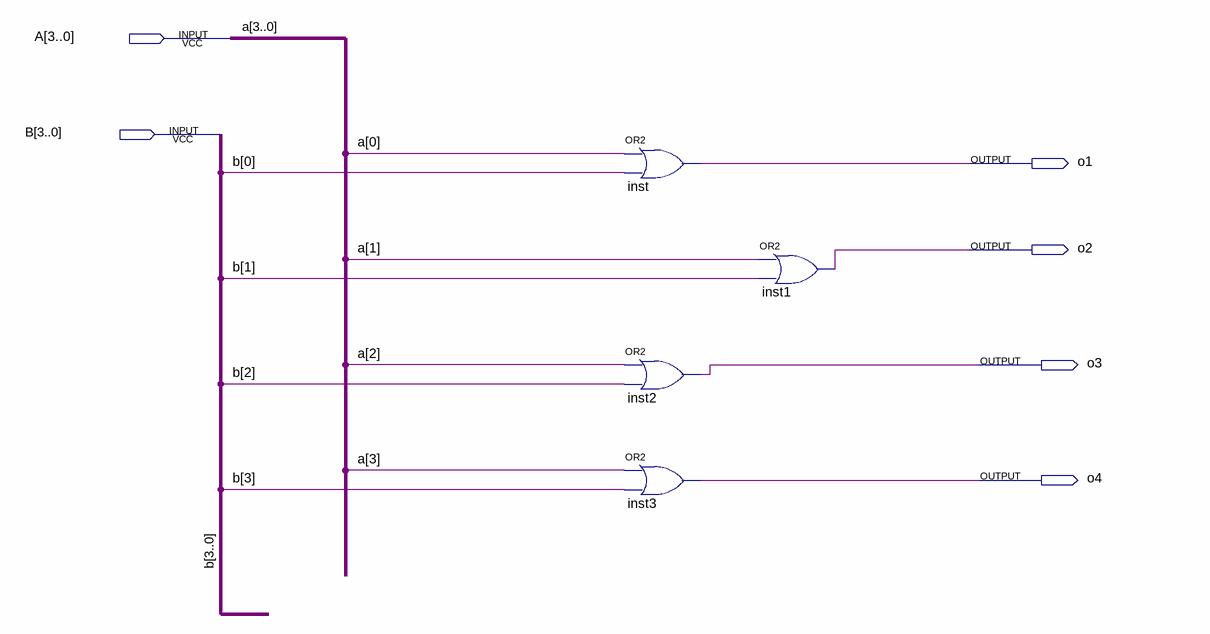
[diagram p0: schematic sheet]
// Quartus schematic 4bit_or.bdf as structural Verilog: 4 symbols, 6 pins
module \4bit_or  (
  input  [3:0] A,
  input  [3:0] B,
  output o1,
  output o2,
  output o3,
  output o4
);

  or inst (o1, A[0], B[0]);
  or inst2 (o3, A[2], B[2]);
  or inst3 (o4, A[3], B[3]);
  or inst1 (o2, A[1], B[1]);
endmodule
